# Altium schematic sheet CAN_Module.SchDoc
size A4; SheetNumber: 1; SheetTotal: 1
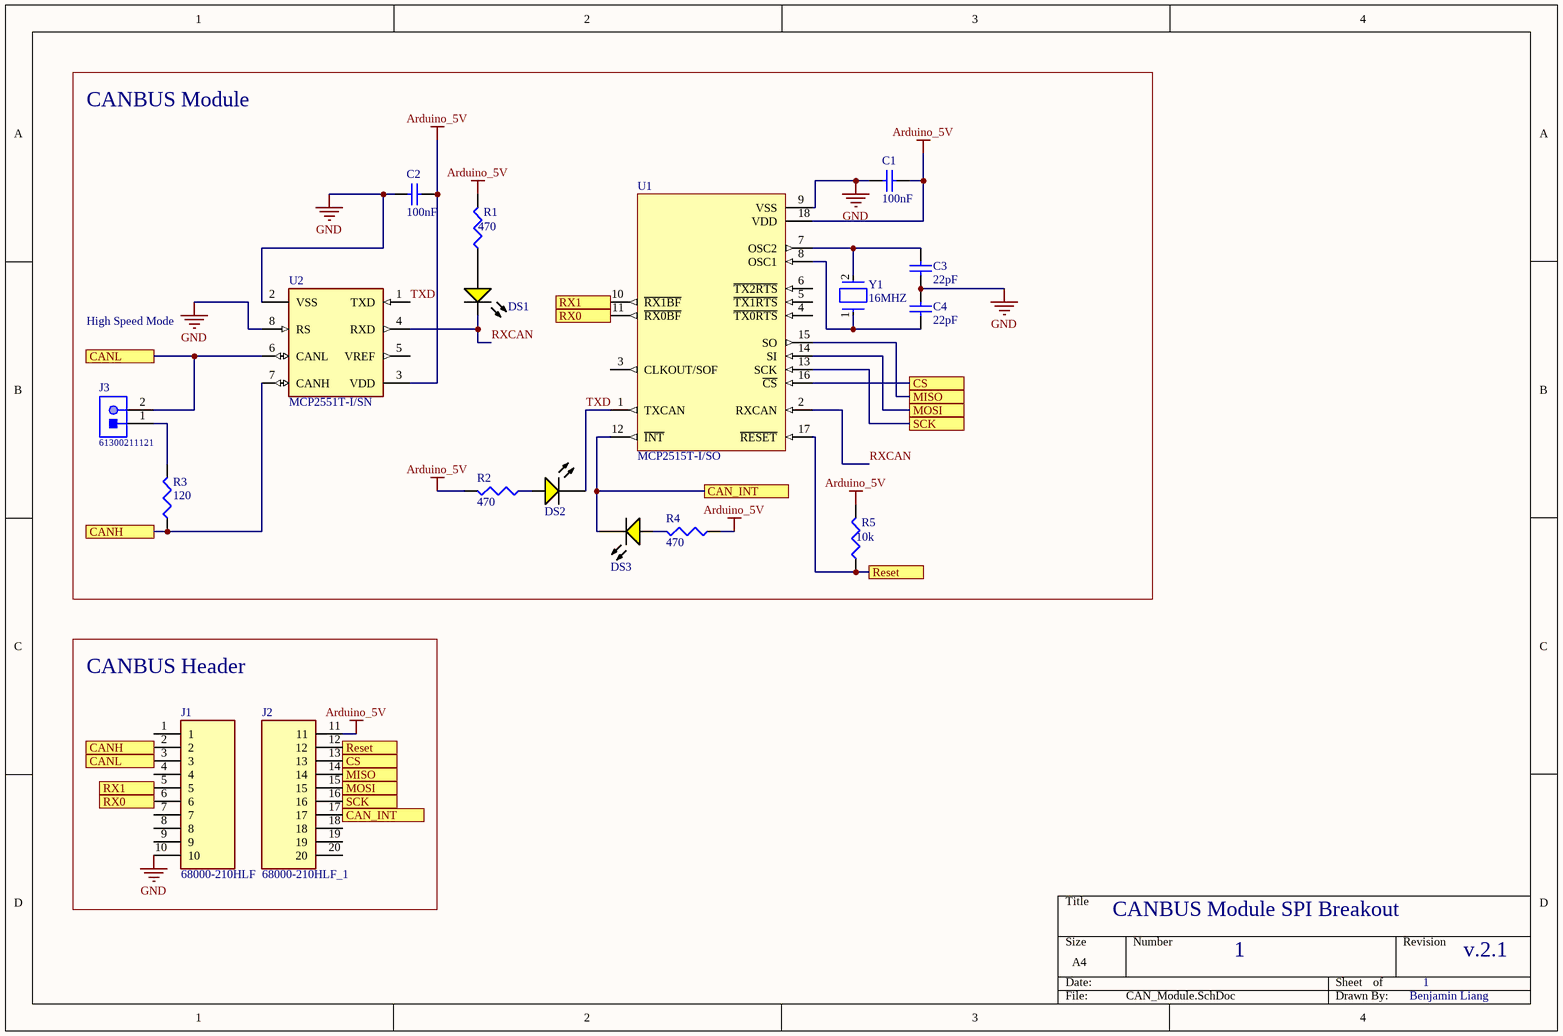
[diagram p0: CAN_Module.SchDoc]

## Parts
C1  100nF  [C1206]
C2  100nF  [C1206]
C3  22pF  [C1206]
C4  22pF  [C1206]
DS1  HLMP-1719  [AVAG-HLMP-1719_V]  (value not drawn)
DS2  HLMP-1719  [AVAG-HLMP-1719_V]  (value not drawn)
DS3  HLMP-1719  [AVAG-HLMP-1719_V]  (value not drawn)
J1  68000-210HLF  [HDRV10W63P0X254_1X10_2540X241X858P]
J2  68000-210HLF_1  [HDRV10W63P0X254_1X10_2540X241X858P]
J3  61300211121  [61300211121]
R1  470  [J1-0603]
R2  470  [J1-0603]
R3  120  [J1-0603]
R4  470  [J1-0603]
R5  10k  [J1-0603]
U1  MCP2515T-I/SO  [SOIC-SO18_N]
U2  MCP2551T-I/SN  [FP-C04-057-SN-IPC_B]
Y1  16MHZ  [FP-ABLS-MFG]

## Blocks framed on the sheet
CANBUS Module: C1-C4 DS1-DS3 J3 R1-R5 U1 U2 Y1
CANBUS Header: J1 J2

## Ports
CAN_INT, CANH, CANL, CS, MISO, MOSI, Reset, RX0, RX1, SCK

## Nets
Arduino_5V: C1.1 C2.1 J2.11 R1.2 R2.2 R4.1 R5.2 U1.18(VDD) U2.3(VDD)
GND: C1.2 C2.2 C3.1 C4.2 J1.10 U1.9(VSS) U2.2(VSS) U2.8(RS)
CAN_INT: DS3.2(K) J2.17 U1.12(~{INT}) ; port CAN_INT
CANH: J1.2 R3.1 U2.7(CANH) ; port CANH
CANL: J1.3 J3.2 U2.6(CANL) ; port CANL
CS: J2.13 U1.16(~{CS}) ; port CS
MISO: J2.14 U1.15(SO) ; port MISO
MOSI: J2.15 U1.14(SI) ; port MOSI
Reset: J2.12 R5.1 U1.17(~{RESET}) ; port Reset
RX0: J1.6 U1.11(~{RX0BF}) ; port RX0
RX1: J1.5 U1.10(~{RX1BF}) ; port RX1
RXCAN: DS1.2(K) U1.2(RXCAN) U2.4(RXD)
SCK: J2.16 U1.13(SCK) ; port SCK
TXD: DS2.2(K) U1.1(TXCAN) U2.1(TXD)
NetC3_2: C3.2 U1.7(OSC2) Y1.2
NetC4_1: C4.1 U1.8(OSC1) Y1.1
NetDS1_1: DS1.1(A) R1.1
NetDS2_1: DS2.1(A) R2.1
NetDS3_1: DS3.1(A) R4.2
NetJ3_1: J3.1 R3.2

Not connected (* = marked no-connect by the designer): J1 1 4 7 8 9; J2 18 19 20; U1 3(CLKOUT/SOF) 4(~{TX0RTS}) 5(~{TX1RTS}) 6(~{TX2RTS}); U2 5(VREF)

## Notes on the sheet
- High Speed Mode
- CANBUS Module SPI Breakout
- 1
- v.2.1
- Benjamin Liang

## Library data of the parts
C1-C4 = Cap Semi: Capacitor (Semiconductor SIM Model); Published: 8-Jun-2000; LatestRevisionDate: 29-May-2009; LatestRevisionNote: IPC-7351 Footprint Added.; PackageReference: C1206; Publisher: Altium Limited; PackageDescription: Chip Capacitor
  C1 C2: Value: 100nF
  C3 C4: Value: 22pF
DS1-DS3 = CMP-2000-06410-1: Low Current LED Lamp, T-1 (3 mm), 1.8 V, 2 mA, -40 to 100 degC, 2-Pin THD, RoHS, Bulk; Manufacturer: AvagoTechnologies; Type: Uni-Color; Viewing Angle: 50°; Color: Yellow; Lens Shape Type: Circular; Number of LEDs: 1; Intensity: 2.1mcd; Mounting Orientation: TopMount; Dominant Wavelength/Color Temperature: 585nm; Lens Appearance: ColoredDiffused; Manufacturer URL: http://www.avagotech.com/; Mounting Technology: ThroughHole; Pin Count: 2; Datasheet URL: http://www.avagotech.com/docs/AV02-1557EN; Package: 2T-1; Packaging: Bulk; Package Description: 2-Pin Through Hole Device, Body Dia 3.175 mm; Category: LEDs; Mounting: ThroughHole; Datasheet Version: 07/2014; Package Reference: HLMP-1719
J1 = 68000-210HLF: Connector; Manufacturer_Name: Amphenol; Datasheet Link: https://cdn.amphenol-icc.com/media/wysiwyg/files/drawing/68000.pdf; Height: 8.58mm; Manufacturer_Part_Number: 68000-210HLF; Mouser Part Number: 649-68000-210HLF; Mouser Price/Stock: https://www.mouser.co.uk/ProductDetail/Amphenol-FCI/68000-210HLF?qs=QKvFUfBIyQINb7f%2F4SDc2A%3D%3D; Arrow Part Number: 68000-210HLF; Arrow Price/Stock: https://www.arrow.com/en/products/68000-210hlf/amphenol-fci
J2 = 68000-210HLF_1: Connector; Manufacturer_Name: Amphenol; Datasheet Link: https://cdn.amphenol-icc.com/media/wysiwyg/files/drawing/68000.pdf; Height: 8.58mm; Manufacturer_Part_Number: 68000-210HLF; Mouser Part Number: 649-68000-210HLF; Mouser Price/Stock: https://www.mouser.co.uk/ProductDetail/Amphenol-FCI/68000-210HLF?qs=QKvFUfBIyQINb7f%2F4SDc2A%3D%3D; Arrow Part Number: 68000-210HLF; Arrow Price/Stock: https://www.arrow.com/en/products/68000-210hlf/amphenol-fci
J3 = CMP-1712-00002-4: THT Vertical Pin Header WR-PHD, Pitch 2.54 mm, Single Row, 2 pins; Manufacturer: Wurth Elektronik; Rated Current: 3A; Gender: Male; Withstanding Voltage: 500VAC; Working Voltage: 250VAC; Pitch: 2.54mm; Contact Resistance: 20mOhm; Pin Number: 2; Mounting Technology: THT; Orientation: Vertical; Operating Temperature: -40to105degC; Packaging: Bag; Publisher: WurthElektronik; Datasheet URL: https://katalog.we-online.de/em/datasheet/6130xx11121.pdf; Manufacturer URL: http://www.we-online.de; Row Number: Single; Package Reference: 61300211121; Part Number: 61300211121
R1-R5 = Res3: Resistor; Value: 220; Published: 8-Jun-2000; LatestRevisionDate: 29-May-2009; LatestRevisionNote: IPC-7351 Footprint Added.; PackageReference: J1-0603; Publisher: Altium Limited; PackageDescription: Chip Resistor
U1 = CMP-0186-00139-2: Stand-Alone CAN Controller With SPI Interface, 18-Pin SOIC, Industrial Temperature, Tape and Reel; RevisionNote: URLs added. DatasheetVersion updated.; ComponentLink1Description: Manufacturer URL; Code_JEDEC: MS-013; ComponentLink2URL: http://ww1.microchip.com/downloads/en/DeviceDoc/21801f.pdf; ComponentLink3Description: Package Specification; PackageVersion: revBB, Aug-2009; PackageReference: SOIC-SO18; ComponentLink2Description: Datasheet; DatasheetVersion: revF, Oct-2010; PackageDescription: 18-Lead Plastic Small Outline (SO) - Wide 7.50mm Body [SOIC]; ComponentLink1URL: http://www.microchip.com/; ComponentLink3URL: http://www.microchip.com/stellent/groups/techpub_sg/documents/packagingspec/en012702.pdf
U2 = CMP-0186-00037-3: IC TRANSCEIVER HALF 1/1 8SOIC; Interface: CAN; Nominal Supply Current: 75mA; Number of Receive Buffers: 1; Operating Supply Voltage: 5V; Data Rate: 1Mbps; Max Supply Voltage: 5.5V; Min Supply Voltage: 4.5V; Package Quantity: 3300; Packaging: Tape and Reel; REACH SVHC: No SVHC; Radiation Hardening: No; Case/Package: SOIC; Max Supply Current: 75mA; Lead Free: Lead Free; Number of Transmit Buffers: 1; Length: 4.9mm; Number of Transceivers: 1; Min Operating Temperature: -40°C; Number of Pins: 8; Height: 1.5mm; Max Operating Temperature: 85°C; Number of Receivers: 1; Logic Function: Transceiver; Width: 3.9mm; Mount: Surface Mount; Number of Drivers: 1
Y1 = CMP-27762-000003-1: CRYSTAL 16.0000MHZ 18PF SMD / ABLS-16.000MHZ-K4T; Manufacturer: Abracon; Stability: 50ppm; Tolerance: 30ppm; Standoff Height: 0mm; Esr: 40Ω; ComponentLink2URL: https://abracon.com/Resonators/abls.pdf; Frequency: 16MHz; Temperature Range High: +125°C; Package: ABLS; Device Class L3: Crystals; Temperature: -40°C to +125°C; Load Capacitance: 18pF; Device Class L2: Crystals / Oscillators; Mouser Description: Crystal 16MHz ±30ppm (Tol) ±50ppm (Stability) 18pF FUND 40Ohm 2-Pin HC-49/US SMD T/R; Category: Crys; ComponentLink2Description: Datasheet; Manufacturer Part Number: ABLS-16.000MHZ-K4T; Series: ABLS; Automotive: No; Octopart: https://octopart.com/abls-16.000mhz-k4t-abracon-18618626; RoHS: TRUE; Digikey Description: CRYSTAL 16.0000MHZ 18PF SMD; Temperature Range Low: -40°C; Lead Free: Yes; Height: 4.3mm; Device Class L1: Passive Components